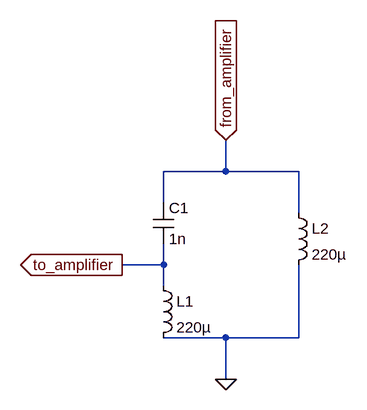
[diagram p0: schematic tank_circuit.asc]
tank_circuit.asc, the LTspice schematic file:
Version 4
SHEET 1 880 680
WIRE 224 0 224 -48
WIRE 224 0 128 0
WIRE 336 0 224 0
WIRE 128 48 128 0
WIRE 336 64 336 0
WIRE 128 144 128 112
WIRE 128 144 64 144
WIRE 128 176 128 144
WIRE 224 256 128 256
WIRE 336 256 336 144
WIRE 336 256 224 256
WIRE 224 320 224 256
FLAG 224 320 0
FLAG 64 144 to_amplifier
IOPIN 64 144 Out
FLAG 224 -48 from_amplifier
IOPIN 224 -48 In
SYMBOL ind 112 160 R0
SYMATTR InstName L1
SYMATTR Value 220µ
SYMBOL ind 320 48 R0
SYMATTR InstName L2
SYMATTR Value 220µ
SYMBOL cap 112 48 R0
SYMATTR InstName C1
SYMATTR Value 1n

The netlist it stands for:
* tank_circuit.asc
L1 to_amplifier 0 220µ
L2 from_amplifier 0 220µ
C1 from_amplifier to_amplifier 1n
.backanno
.end